# Altium schematic sheet FPGA-8.SchDoc
size A3; Date: Date; CompanyName: HESSO; Engineer: Name; Address1: Route du Rawyl 47; Address2: 1950 Sion; Address3: Switzerland; ProjectName: Project Name
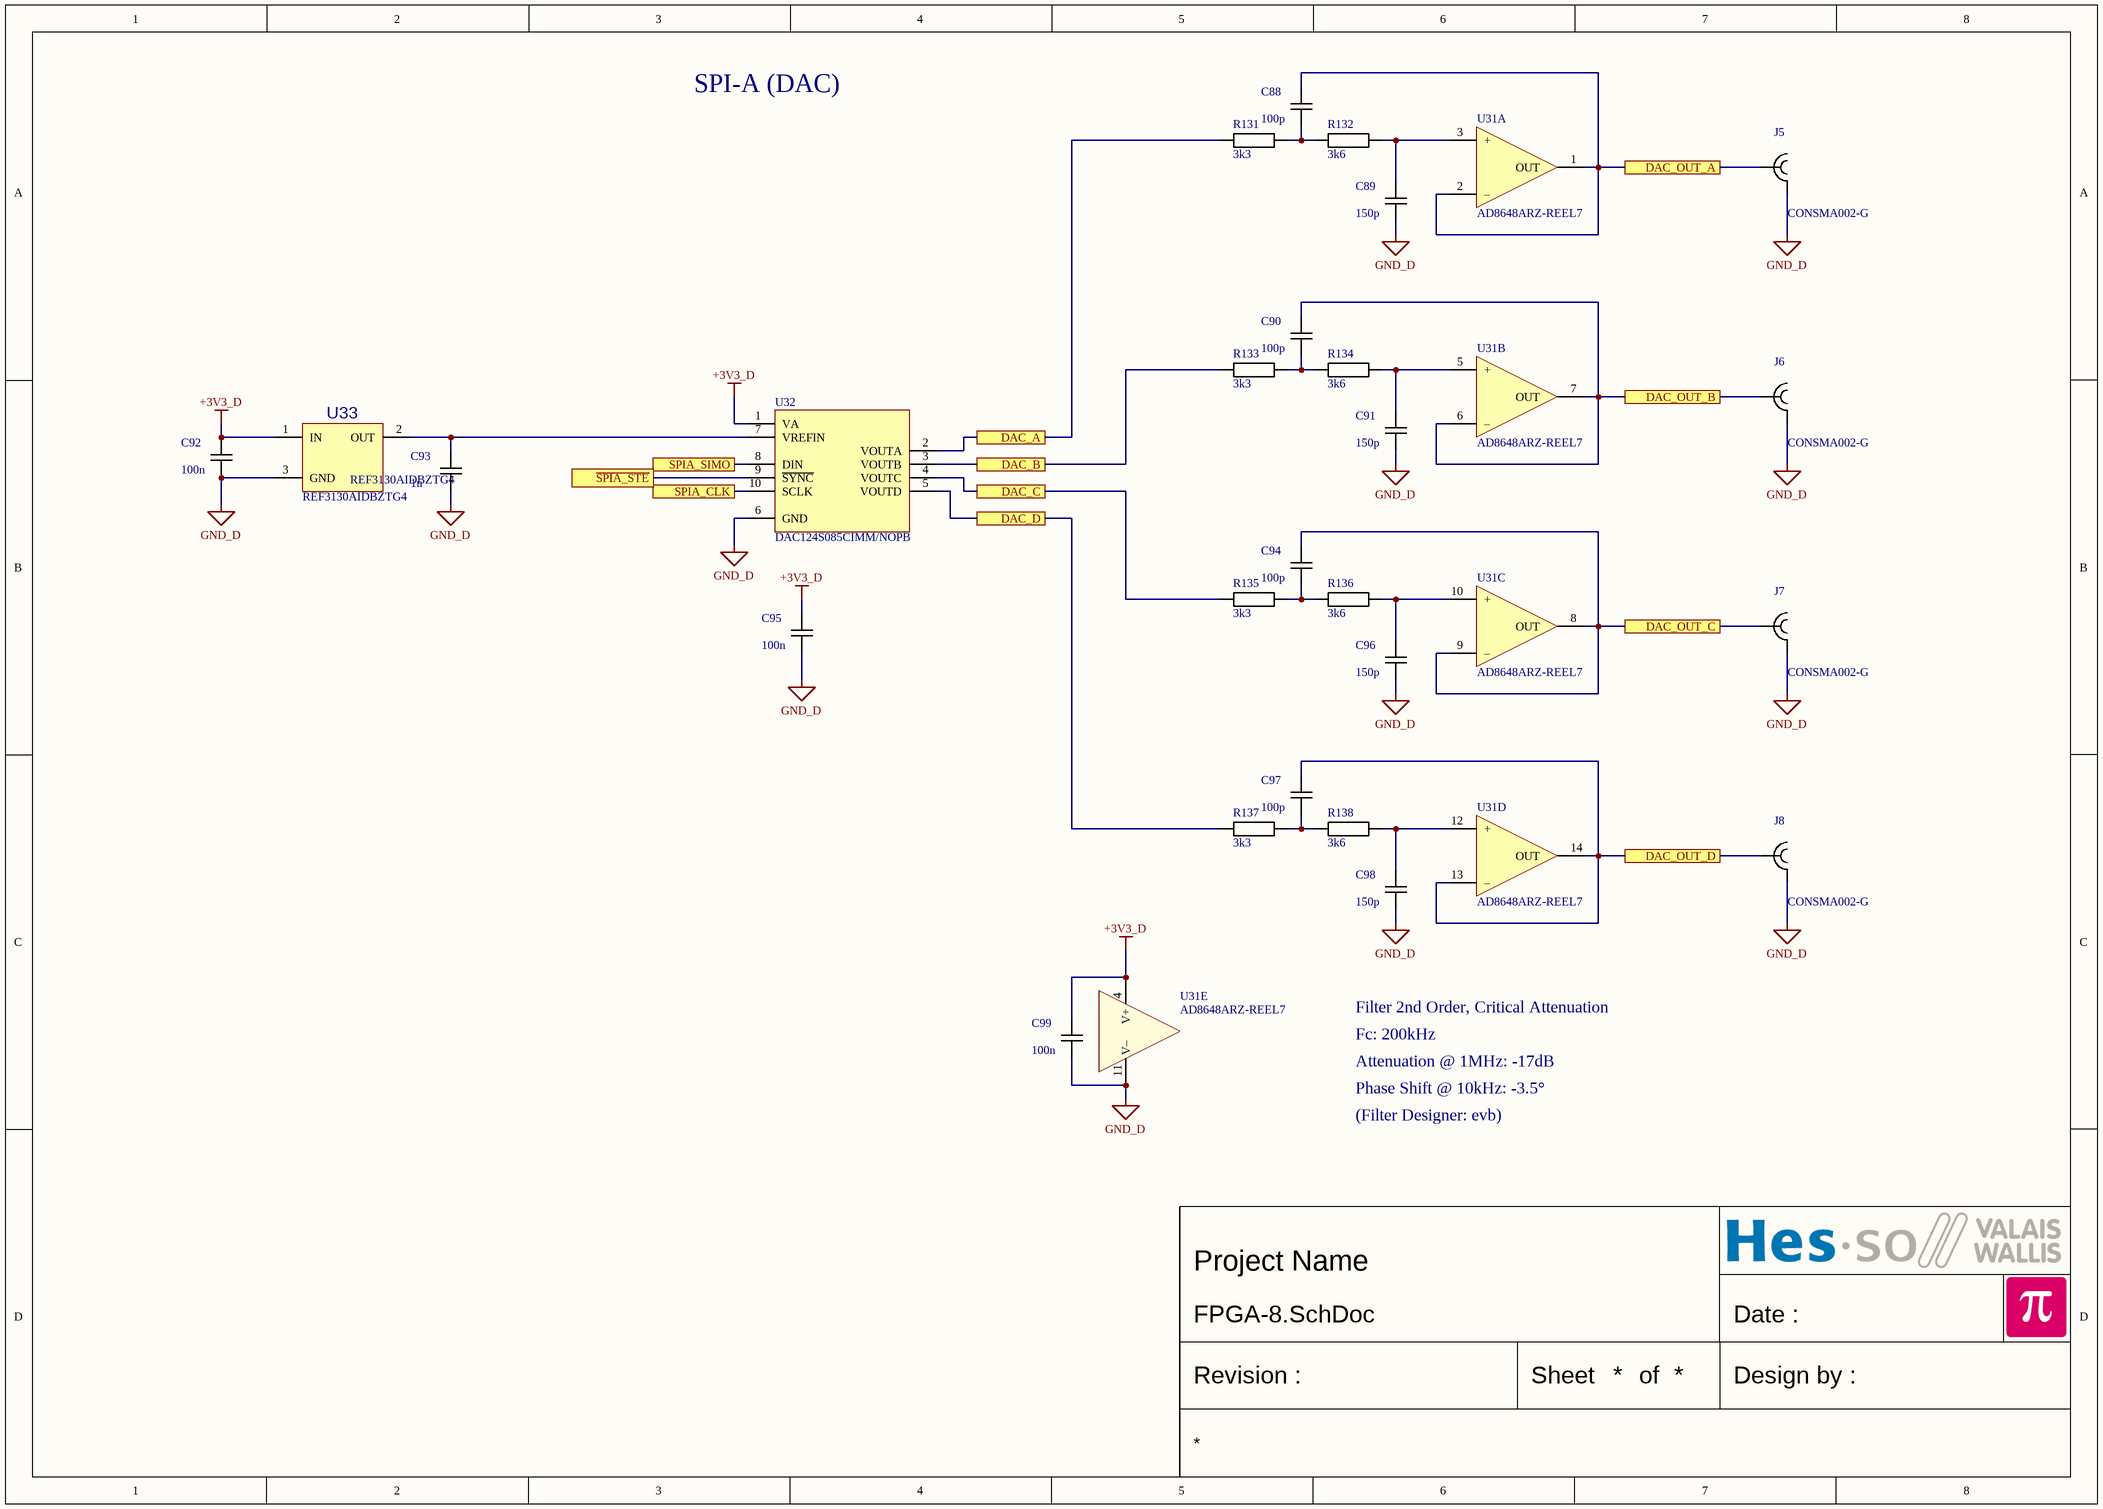
[diagram p0: FPGA-8.SchDoc]

## Parts
C88  100p  [CAPACITOR 2012 REFLOW]
C89  150p  [CAPACITOR 2012 REFLOW]
C90  100p  [CAPACITOR 2012 REFLOW]
C91  150p  [CAPACITOR 2012 REFLOW]
C92  100n  [CAPACITOR 2012 REFLOW]
C93  1u  [CAPACITOR 2012 REFLOW]
C94  100p  [CAPACITOR 2012 REFLOW]
C95  100n  [CAPACITOR 1608 REFLOW]
C96  150p  [CAPACITOR 2012 REFLOW]
C97  100p  [CAPACITOR 2012 REFLOW]
C98  150p  [CAPACITOR 2012 REFLOW]
C99  100n  [CAPACITOR 1608 REFLOW]
J5  CONSMA002-G  [SMA TH Right Angle Linx CONSMA002]
J6  CONSMA002-G  [SMA TH Right Angle Linx CONSMA002]
J7  CONSMA002-G  [SMA TH Right Angle Linx CONSMA002]
J8  CONSMA002-G  [SMA TH Right Angle Linx CONSMA002]
R131  3k3  [RESISTOR 2012 REFLOW]
R132  3k6  [RESISTOR 2012 REFLOW]
R133  3k3  [RESISTOR 2012 REFLOW]
R134  3k6  [RESISTOR 2012 REFLOW]
R135  3k3  [RESISTOR 2012 REFLOW]
R136  3k6  [RESISTOR 2012 REFLOW]
R137  3k3  [RESISTOR 2012 REFLOW]
R138  3k6  [RESISTOR 2012 REFLOW]
U31  AD8648ARZ-REEL7  [SO14 P1.27 C4.0X8.8 H1.75]  (parts A,B,C,D,E of 5)
U32  DAC124S085CIMM/NOPB  [VSSOP10 P0.5 C3.1X3.1 H1.1]
U33  REF3130AIDBZTG4  [SOT23 P0.95 C1.6x3.0 H1.3]

## Ports
DAC_A, DAC_B, DAC_C, DAC_D, DAC_OUT_A, DAC_OUT_B, DAC_OUT_C, DAC_OUT_D, SPIA_CLK, SPIA_SIMO, ~{SPIA_STE}

## Nets
+3V3_D: C92.2 C95.2 C99.2 U31.4(V+) U32.1(VA) U33.1(IN)
GND_D: C89.1 C91.1 C92.1 C93.1 C95.1 C96.1 C98.1 C99.1 J5.2 J6.2 J7.2 J8.2 U31.11(V–) U32.6(GND) U33.3(GND)
~{SPIA_STE}: U32.9(~{SYNC}) ; port ~{SPIA_STE}
DAC_A: R131.1 U32.2(VOUTA) ; port DAC_A
DAC_B: R133.1 U32.3(VOUTB) ; port DAC_B
DAC_C: R135.1 U32.4(VOUTC) ; port DAC_C
DAC_D: R137.1 U32.5(VOUTD) ; port DAC_D
DAC_OUT_A: C88.2 J5.1 U31.1(OUT) U31.2(–) ; port DAC_OUT_A
DAC_OUT_B: C90.2 J6.1 U31.6(–) U31.7(OUT) ; port DAC_OUT_B
DAC_OUT_C: C94.2 J7.1 U31.8(OUT) U31.9(–) ; port DAC_OUT_C
DAC_OUT_D: C97.2 J8.1 U31.13(–) U31.14(OUT) ; port DAC_OUT_D
SPIA_CLK: U32.10(SCLK) ; port SPIA_CLK
SPIA_SIMO: U32.8(DIN) ; port SPIA_SIMO
NetC88_1: C88.1 R131.2 R132.1
NetC89_2: C89.2 R132.2 U31.3(+)
NetC90_1: C90.1 R133.2 R134.1
NetC91_2: C91.2 R134.2 U31.5(+)
NetC93_2: C93.2 U32.7(VREFIN) U33.2(OUT)
NetC94_1: C94.1 R135.2 R136.1
NetC96_2: C96.2 R136.2 U31.10(+)
NetC97_1: C97.1 R137.2 R138.1
NetC98_2: C98.2 R138.2 U31.12(+)

## Notes on the sheet
- SPI-A (DAC)
- Filter 2nd Order, Critical Attenuation
- Fc: 200kHz
- Attenuation @ 1MHz: -17dB
- Phase Shift @ 10kHz: -3.5°
- (Filter Designer: evb)
- Date :
- Revision :
- Sheet
- of
- Design by :

## Library data of the parts
C88-C92 C94 C96-C98 = Capacitor: Capacitor X7R 10% 50V 2012(0805)
  C88 C90 C94 C97: Value: 100p
  C89 C91 C96 C98: Value: 150p
  C92: Value: 100n
C93 = Capacitor: Capacitor X7R 10% 10V 2012(0805); Value: 1u
C95 C99 = Capacitor: Capacitor X7R 10% 50V 1608(0603); Value: 100n
J5-J8 = SMA TH RIGHT ANGLE LINX CONSMA002: Manufacturer: Linx Technologies; Value: CONSMA002-G; Mouser No.: 712-CONSMA002-G
R131-R138 = Resistor: Resistor 1% 50V 125mW 2012(0805)
  R131 R133 R135 R137: Value: 3k3
  R132 R134 R136 R138: Value: 3k6
U31 = OPA QUAD: Generic quad OPA 14 pins; Manufacturer: Analog Devices; Value: AD8648ARZ-REEL7; Mouser No.: 584-AD8648ARZ-R7
U32 = DAC124S085CIMM: DAC124S085 12-Bit Micro Power Quad Digital-to-Analog Converter With Rail-to-Rail Output; Manufacturer: Texas Instruments; Value: DAC124S085CIMM/NOPB; Mouser No.: 926-DAC124S085CIMMNO
U33 = REFERENCE SOT23 IN-OUT- GND: Generic Positive Voltage Reference; Manufacturer: Texas Instruments; Value: REF3130AIDBZTG4; Mouser No.: 595-REF3130AIDBZTG4